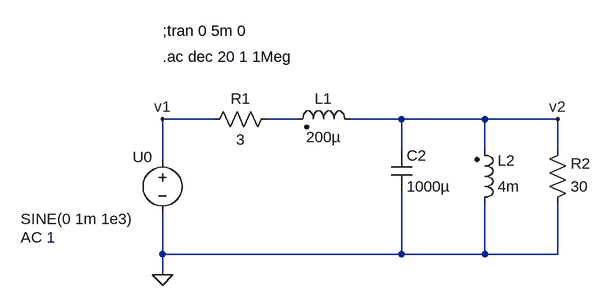
[diagram p0: schematic hw7p2.asc]
hw7p2.asc, the LTspice schematic file:
Version 4
SHEET 1 1036 680
WIRE -48 16 -128 16
WIRE 80 16 32 16
WIRE 240 16 160 16
WIRE 368 16 240 16
WIRE 480 16 368 16
WIRE 240 64 240 16
WIRE 368 64 368 16
WIRE 480 64 480 16
WIRE -128 80 -128 16
WIRE -128 224 -128 160
WIRE 240 224 240 128
WIRE 240 224 -128 224
WIRE 368 224 368 144
WIRE 368 224 240 224
WIRE 480 224 480 144
WIRE 480 224 368 224
WIRE -128 256 -128 224
FLAG -128 256 0
FLAG -128 16 v1
FLAG 480 16 v2
SYMBOL voltage -128 64 R0
WINDOW 0 -46 10 Left 2
WINDOW 3 -218 106 Left 2
WINDOW 123 -218 134 Left 2
WINDOW 39 0 0 Left 2
SYMATTR InstName U0
SYMATTR Value SINE(0 1m 1e3)
SYMATTR Value2 AC 1
SYMBOL res 48 0 R90
WINDOW 0 0 56 VBottom 2
WINDOW 3 32 56 VTop 2
SYMATTR InstName R1
SYMATTR Value 3
SYMBOL res 464 160 M180
WINDOW 0 36 76 Left 2
WINDOW 3 36 40 Left 2
SYMATTR InstName R2
SYMATTR Value 30
SYMBOL ind2 176 32 M270
WINDOW 0 32 56 VTop 2
WINDOW 3 4 56 VBottom 2
SYMATTR InstName L1
SYMATTR Value 200µ
SYMATTR Type ind
SYMBOL ind2 352 160 M180
WINDOW 0 36 80 Left 2
WINDOW 3 36 40 Left 2
SYMATTR InstName L2
SYMATTR Value 4m
SYMATTR Type ind
SYMBOL cap 224 64 R0
SYMATTR InstName C2
SYMATTR Value 1000µ
TEXT -128 -120 Left 2 !;tran 0 5m 0
TEXT -128 -80 Left 2 !.ac dec 20 1 1Meg

The netlist it stands for:
* hw7p2.asc
V§U0 v1 0 SINE(0 1m 1e3) AC 1
R1 N001 v1 3
R2 0 v2 30
L1 v2 N001 200µ
L2 0 v2 4m
C2 v2 0 1000µ
;tran 0 5m 0
.ac dec 20 1 1Meg
.backanno
.end